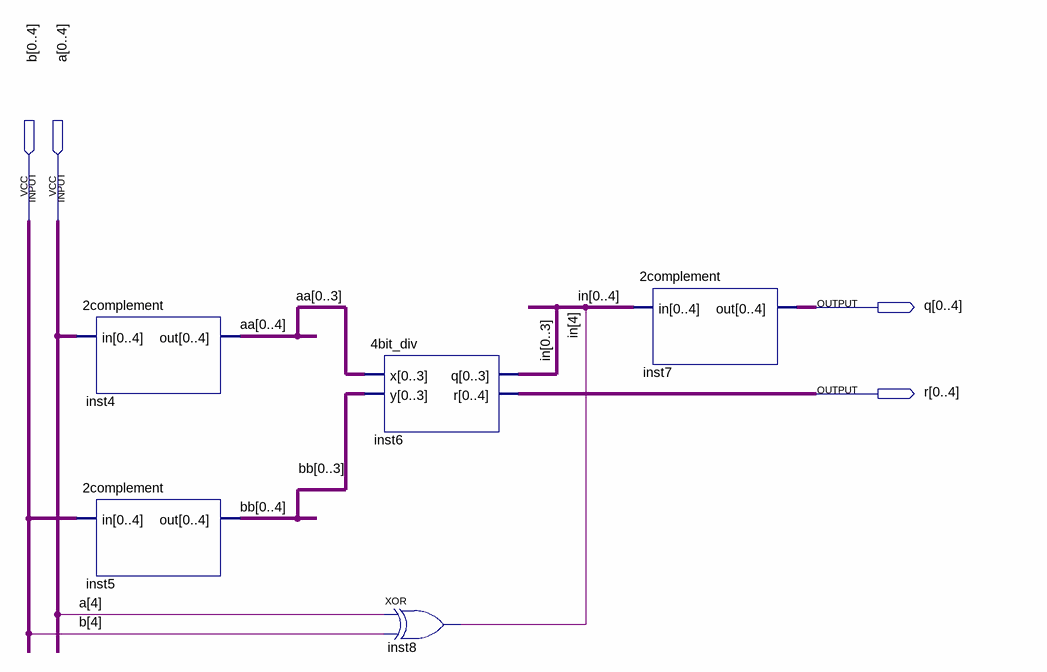
[diagram p0: schematic sheet]
// Quartus schematic 5bit_divider.bdf as structural Verilog: 5 symbols, 4 pins
module \5bit_divider  (
  input  [0:4] b,
  input  [0:4] a,
  output [0:4] q,
  output [0:4] r
);

  wire [4:0] aa, bb, in;

  \2complement  inst4 (.in(a), .out({aa[0], aa[1], aa[2], aa[3], aa[4]}));
  \2complement  inst5 (.in(b), .out({bb[0], bb[1], bb[2], bb[3], bb[4]}));
  \4bit_div  inst6 (
    .x({aa[0], aa[1], aa[2], aa[3]}), .y({bb[0], bb[1], bb[2], bb[3]}), .q({in[0], in[1], in[2], in[3]}),
    .r(r));
  xor inst8 (in[4], a[4], b[4]);
  \2complement  inst7 (.in({in[0], in[1], in[2], in[3], in[4]}), .out(q));
endmodule
